# Altium project Mid_Project.PrjPcb
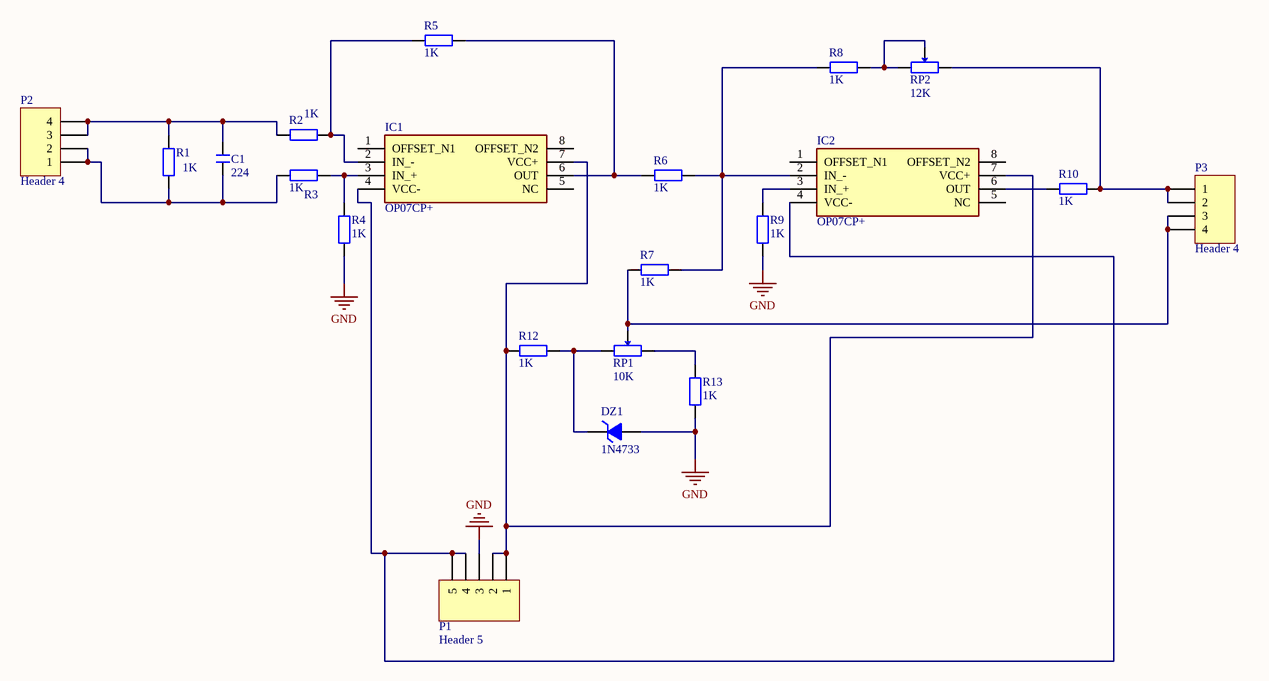
[diagram p0: I-V E9A_05_6231.SchDoc]
1 sheet, 21 parts. Net scope: global (net labels, ports and power ports of the same name join across sheets).
Board file: I-V E9A_05_6231.PcbDoc

## Sheet I-V E9A_05_6231.SchDoc
size A4; SheetNumber: 1; SheetTotal: 1; SPICEModelCacheEIZJVPGM: <root> / <DocumentId>EIZJVPGM</DocumentId> / </root>

### Parts
C1  224  [MLCC5.08-A]
DZ1  1N4733  [DO-41]
IC1  OP07CP+  [DIP794W53P254L959H508Q8N]
IC2  OP07CP+  [DIP794W53P254L959H508Q8N]
P1  Header 5  [POWER PLUG5]
P2  Header 4  [HDR1X4]
P3  Header 4  [HDR1X4]
R1  1K  [RS 1/4W]
R2  1K  [RS 1/4W]
R3  1K  [RS 1/4W]
R4  1K  [RS 1/4W]
R5  1K  [RS 1/4W]
R6  1K  [RS 1/4W]
R7  1K  [RS 1/4W]
R8  1K  [RS 1/4W]
R9  1K  [RS 1/4W]
R10  1K  [RS 1/4W]
R12  1K  [RS 1/4W]
R13  1K  [RS 1/4W]
RP1  10K  [3266Y]
RP2  12K  [3266Y]

### Nets
GND: DZ1.1(A) P1.3 R4.1 R9.1 R13.1
NetC1_1: C1.1 P2.1 P2.2 R1.1 R3.1
NetC1_2: C1.2 P2.3 P2.4 R1.2 R2.1
NetDZ1_2: DZ1.2(K) R12.2 RP1.1
NetIC1_2: IC1.2(IN_-) R2.2 R5.1
NetIC1_3: IC1.3(IN_+) R3.2 R4.2
NetIC1_4: IC1.4(VCC-) IC2.4(VCC-) P1.4 P1.5
NetIC1_6: IC1.6(OUT) R5.2 R6.1
NetIC1_7: IC1.7(VCC+) IC2.7(VCC+) P1.1 P1.2 R12.1
NetIC2_2: IC2.2(IN_-) R6.2 R7.2 R8.1
NetIC2_3: IC2.3(IN_+) R9.2
NetIC2_6: IC2.6(OUT) R10.1
NetP3_1: P3.1 P3.2 R10.2 RP2.3
NetP3_3: P3.3 P3.4 R7.1 RP1.2
NetR8_2: R8.2 RP2.1 RP2.2
NetR13_2: R13.2 RP1.3

Not connected (* = marked no-connect by the designer): IC1 1(OFFSET_N1) 5(NC) 8(OFFSET_N2); IC2 1(OFFSET_N1) 5(NC) 8(OFFSET_N2)

### Library data of the parts
C1 = C-MLCC: 独石电容; 版权归属: 源创客; BOM名称: 独石电容; 学习资源: www.ooocke.com
DZ1 = 1N4733: 5.1V/1W稳压管; 版权归属: 源创客; BOM名称: 5.1V/1W稳压管; 学习资源: www.ooocke.com
IC1 IC2 = OP07CP+: Integrated Circuit; Manufacturer_Name: Texas Instruments; Height: 5.08mm; Manufacturer_Part_Number: OP07CP+; Mouser Part Number: N/A; Mouser Price/Stock: https://www.mouser.co.uk/ProductDetail/Texas-Instruments/OP07CP%2b?qs=iZ8gpeFYjbuxAroH12iSPg%3D%3D
P1 = Header 5: Header, 5-Pin; LatestRevisionDate: 17-Jul-2002; LatestRevisionNote: Re-released for DXP Platform.; Publisher: Altium Limited
P2 P3 = Header 4: Header, 4-Pin; LatestRevisionDate: 17-Jul-2002; LatestRevisionNote: Re-released for DXP Platform.; Publisher: Altium Limited
R1-R10 R12 R13 = R-CRR: 直插色环电阻; BOM名称: 色环电阻; 版权归属: 源创客; 学习资源: www.ooocke.com
RP1 RP2 = RP-ID: 插件单联电位器; BOM名称: 插件电位器; 版权归属: 源创客; 学习资源: www.ooocke.com